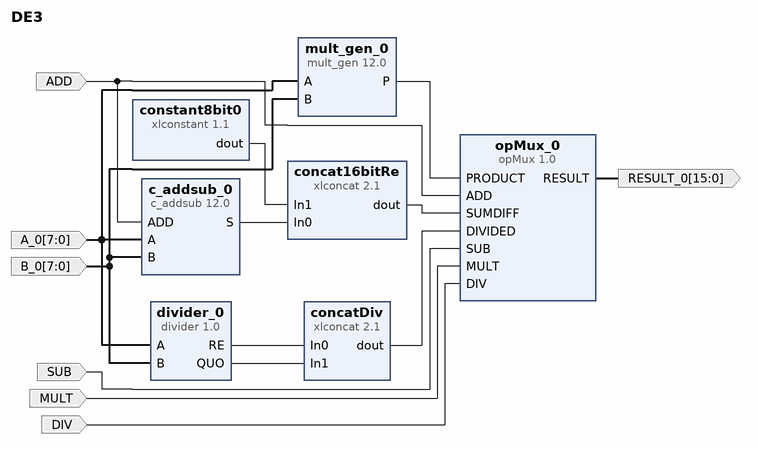
[diagram p0: block diagram of the top level]
# Vivado block design DE3, xc7a35tcpg236-1, Vivado 2019.2
create_bd_design DE3

create_bd_port -dir I -from 7 -to 0 -type data A_0
create_bd_port -dir I -from 7 -to 0 -type data B_0
create_bd_port -dir I ADD
create_bd_port -dir I SUB
create_bd_port -dir I MULT
create_bd_port -dir I DIV
create_bd_port -dir O -from 15 -to 0 RESULT_0

create_bd_cell -type ip -vlnv xilinx.com:ip:c_addsub:12.0 c_addsub_0
set_property -dict [list \
  CONFIG.A_Type Unsigned \
  CONFIG.A_Width 8 \
  CONFIG.Add_Mode Add_Subtract \
  CONFIG.B_Type Unsigned \
  CONFIG.B_Value 00000000 \
  CONFIG.B_Width 8 \
  CONFIG.CE false \
  CONFIG.Latency 0 \
  CONFIG.Out_Width 8 \
] [get_bd_cells c_addsub_0]
create_bd_cell -type ip -vlnv xilinx.com:ip:mult_gen:12.0 mult_gen_0
set_property -dict [list \
  CONFIG.OutputWidthHigh 15 \
  CONFIG.PipeStages 0 \
  CONFIG.PortAType Unsigned \
  CONFIG.PortAWidth 8 \
  CONFIG.PortBType Unsigned \
  CONFIG.PortBWidth 8 \
  CONFIG.Use_Custom_Output_Width true \
] [get_bd_cells mult_gen_0]
create_bd_cell -type ip -vlnv xilinx.com:user:divider:1.0 divider_0
create_bd_cell -type ip -vlnv xilinx.com:user:opMux:1.0 opMux_0
create_bd_cell -type ip -vlnv xilinx.com:ip:xlconcat:2.1 concat16bitRe
set_property -dict {CONFIG.IN0_WIDTH 8 CONFIG.IN1_WIDTH 8} [get_bd_cells concat16bitRe]
create_bd_cell -type ip -vlnv xilinx.com:ip:xlconstant:1.1 constant8bit0
set_property -dict {CONFIG.CONST_VAL 0 CONFIG.CONST_WIDTH 8} [get_bd_cells constant8bit0]
create_bd_cell -type ip -vlnv xilinx.com:ip:xlconcat:2.1 concatDiv
set_property -dict {CONFIG.IN0_WIDTH 8 CONFIG.IN1_WIDTH 8} [get_bd_cells concatDiv]

# ---- connections ----

connect_bd_net [get_bd_pins constant8bit0/dout] [get_bd_pins concat16bitRe/In1]
connect_bd_net [get_bd_pins c_addsub_0/S] [get_bd_pins concat16bitRe/In0]
connect_bd_net [get_bd_pins mult_gen_0/P] [get_bd_pins opMux_0/PRODUCT]
connect_bd_net [get_bd_pins concat16bitRe/dout] [get_bd_pins opMux_0/SUMDIFF]
connect_bd_net [get_bd_pins concatDiv/dout] [get_bd_pins opMux_0/DIVIDED]
connect_bd_net -net A_0_1 [get_bd_ports A_0] [get_bd_pins c_addsub_0/A] [get_bd_pins mult_gen_0/A] [get_bd_pins divider_0/A]
connect_bd_net -net B_0_1 [get_bd_ports B_0] [get_bd_pins c_addsub_0/B] [get_bd_pins mult_gen_0/B] [get_bd_pins divider_0/B]
connect_bd_net [get_bd_ports ADD] [get_bd_pins c_addsub_0/ADD] [get_bd_pins opMux_0/ADD]
connect_bd_net [get_bd_ports SUB] [get_bd_pins opMux_0/SUB]
connect_bd_net [get_bd_ports MULT] [get_bd_pins opMux_0/MULT]
connect_bd_net [get_bd_ports DIV] [get_bd_pins opMux_0/DIV]
connect_bd_net [get_bd_pins opMux_0/RESULT] [get_bd_ports RESULT_0]
connect_bd_net [get_bd_pins divider_0/RE] [get_bd_pins concatDiv/In0]
connect_bd_net [get_bd_pins divider_0/QUO] [get_bd_pins concatDiv/In1]

validate_bd_design
save_bd_design
